# Altium project ESP8266_SENSOR_PCB_Project.PrjPCB
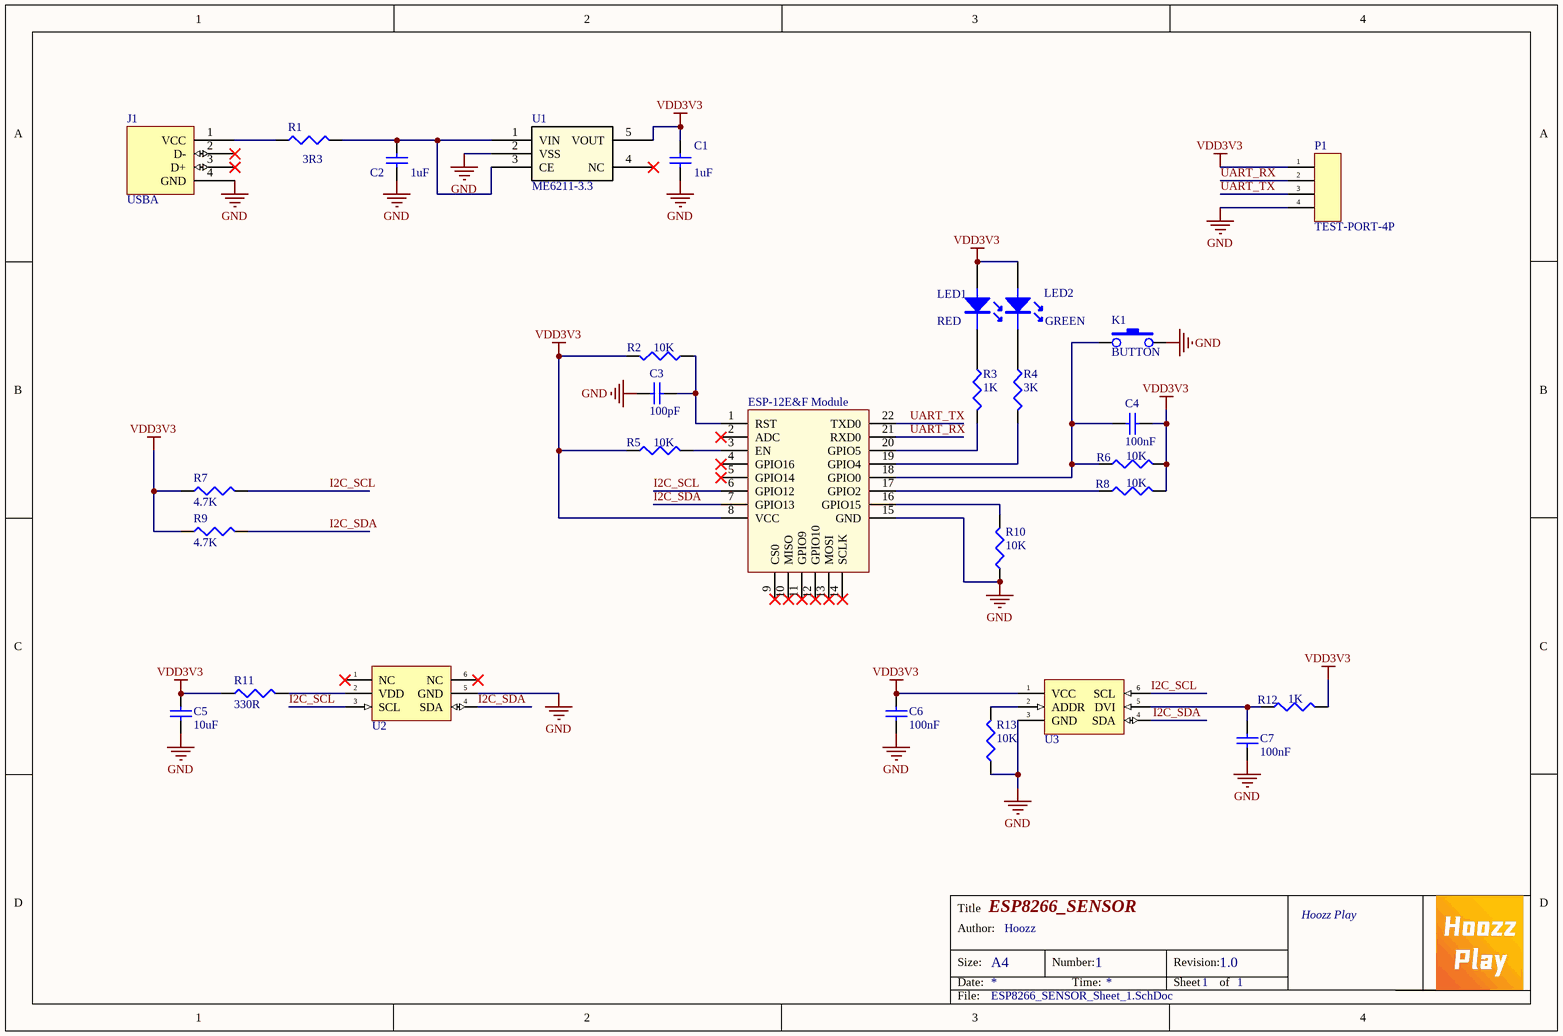
[diagram p0: ESP8266_SENSOR_Sheet_1.SchDoc]
1 sheet, 29 parts. Net scope: global (net labels, ports and power ports of the same name join across sheets).
Board file: ESP8266_SENSOR_PCB_1.PcbDoc

## Sheet ESP8266_SENSOR_Sheet_1.SchDoc: ESP8266_SENSOR
size A4; ApprovedBy: Hoozz; CheckedBy: Hoozz; Author: Hoozz; CompanyName: Hoozz Play; DrawnBy: Hoozz; Organization: Hoozz Play; DocumentNumber: 1; Revision: 1.0; SheetNumber: 1; SheetTotal: 1

### Parts
C1  value 1uF  [0603]  (hidden comment: Cap)
C2  value 1uF  [0603]  (hidden comment: Cap)
C3  value 100pF  [0603]  (hidden comment: Cap)
C4  value 100nF  [0603]  (hidden comment: Cap)
C5  value 10uF  [0603]  (hidden comment: Cap)
C6  value 100nF  [0603]  (hidden comment: Cap)
C7  value 100nF  [0603]  (hidden comment: Cap)
J1  USBA  [USB-A-2]
K1  BUTTON  [BUTTON]
LED1  RED  [LED0603]
LED2  GREEN  [LED0603]
M1  ESP-12E&F Module  [ESP-12E&F Module]
P1  TEST-PORT-4P  [TEST_PORT_4P]
R1  value 3R3  [0603]  (hidden comment: Res)
R2  value 10K  [0603]  (hidden comment: Res)
R3  value 1K  [0603]  (hidden comment: Res)
R4  value 3K  [0603]  (hidden comment: Res)
R5  value 10K  [0603]  (hidden comment: Res)
R6  value 10K  [0603]  (hidden comment: Res)
R7  value 4.7K  [0603]  (hidden comment: Res)
R8  value 10K  [0603]  (hidden comment: Res)
R9  value 4.7K  [0603]  (hidden comment: Res)
R10  value 10K  [0603]  (hidden comment: Res)
R11  value 330R  [0603]  (hidden comment: Res)
R12  value 1K  [0603]  (hidden comment: Res)
R13  value 10K  [0603]  (hidden comment: Res)
U1  ME6211-3.3  [SOT-23-5]
U2  AHT20  [AHT20]  (value not drawn)
U3  BH1750  [BH1750]  (value not drawn)

### Nets
GND: C1.1 C2.1 C3.2 C5.2 C6.2 C7.2 J1.4(GND) K1.2 M1.15(GND) P1.4 R10.1 R13.1 U1.2(VSS) U2.5(GND) U3.3(GND)
VDD3V3: C1.2 C4.1 C5.1 C6.1 LED1.1(A) LED2.1(A) M1.8(VCC) P1.1 R2.2 R5.1 R6.2 R7.1 R8.2 R9.1 R11.1 R12.2 U1.5(VOUT) U3.1(VCC)
I2C_SCL: M1.6(GPIO12) R7.2 U2.3(SCL) U3.6(SCL)
I2C_SDA: M1.7(GPIO13) R9.2 U2.4(SDA) U3.4(SDA)
UART_RX: M1.21(RXD0) P1.2
UART_TX: M1.22(TXD0) P1.3
NetC2_2: C2.2 R1.2 U1.1(VIN) U1.3(CE)
NetC3_1: C3.1 M1.1(RST) R2.1
NetC4_2: C4.2 K1.1 M1.18(GPIO0) R6.1
NetC7_1: C7.1 R12.1 U3.5(DVI)
NetJ1_1: J1.1(VCC) R1.1
NetLED1_2: LED1.2(K) R3.1
NetLED2_2: LED2.2(K) R4.1
NetM1_3: M1.3(EN) R5.2
NetM1_16: M1.16(GPIO15) R10.2
NetM1_17: M1.17(GPIO2) R8.1
NetM1_19: M1.19(GPIO4) R4.2
NetM1_20: M1.20(GPIO5) R3.2
NetR11_2: R11.2 U2.2(VDD)
NetR13_2: R13.2 U3.2(ADDR)

Not connected (* = marked no-connect by the designer): J1 2(D-)* 3(D+)*; M1 2(ADC)* 4(GPIO16)* 5(GPIO14)* 9(CS0)* 10(MISO)* 11(GPIO9)* 12(GPIO10)* 13(MOSI)* 14(SCLK)*; U1 4(NC)*; U2 1(NC)* 6(NC)*

### Notes on the sheet
- Title
- Size:
- Date:
- Author:
- A4
- Number:
- Time:
- Revision:
- Sheet
- of
- File:

### Library data of the parts
C1-C7 = Cap: Capacitor; Published: 8-Jun-2000; LatestRevisionDate: 17-Jul-2002; LatestRevisionNote: Re-released for DXP Platform.; PackageReference: RAD-0.3; Publisher: Altium Limited; PackageDescription: Radial Cap, Thru-Hole; 2 Leads; 0.3 in Pin Spacing
J1 = USBA: USB2.0
LED1 LED2 = LED
R1-R13 = Res: Resistor; Published: 8-Jun-2000; LatestRevisionDate: 29-May-2009; LatestRevisionNote: IPC-7351 Footprint Added.; PackageReference: J1-0603; Publisher: Altium Limited; PackageDescription: Chip Resistor
U1 = ME6211-3.3: No Description Available; Manufacturer: Texas Instruments; Manufacturer_Part_Number: REG102NA-2.5/250; Built_By: EMA_UL_Team; SourceLibrary: TI_2016-07-06; Vendor: Texas Instruments; Copyright: Copyright (C) 2018 Accelerated Designs. All rights reserved; RefDes: RefDes; Type: DEV